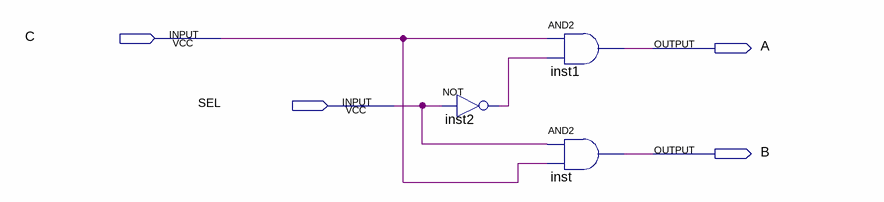
[diagram p0: schematic sheet]
// Quartus schematic DEMUX1I_2O.bdf as structural Verilog: 3 symbols, 4 pins
module DEMUX1I_2O (
  input  C,
  input  SEL,
  output A,
  output B
);

  wire inst2_out;

  not inst2 (inst2_out, SEL);
  and inst1 (A, C, inst2_out);
  and inst (B, SEL, C);
endmodule
